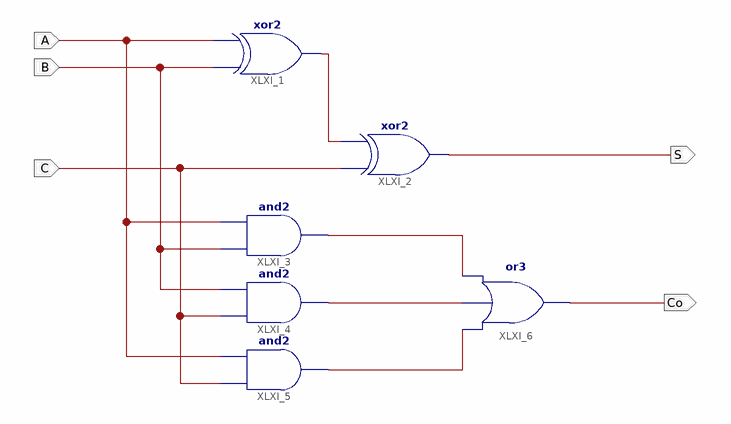
[diagram p0: schematic sheet 1]
// Xilinx ISE schematic Adder1b.sch (kintex7) as structural Verilog: 6 symbols, 5 ports
module Adder1b (
  input  C,
  input  B,
  input  A,
  output S,
  output Co
);

  wire XLXN_4, XLXN_12, XLXN_13, XLXN_14;

  xor XLXI_1 (XLXN_4, B, A);
  xor XLXI_2 (S, C, XLXN_4);
  and XLXI_3 (XLXN_12, B, A);
  and XLXI_4 (XLXN_13, C, B);
  and XLXI_5 (XLXN_14, C, A);
  or XLXI_6 (Co, XLXN_14, XLXN_13, XLXN_12);
endmodule
